# EAGLE design White (EAGLE 9.6.2)
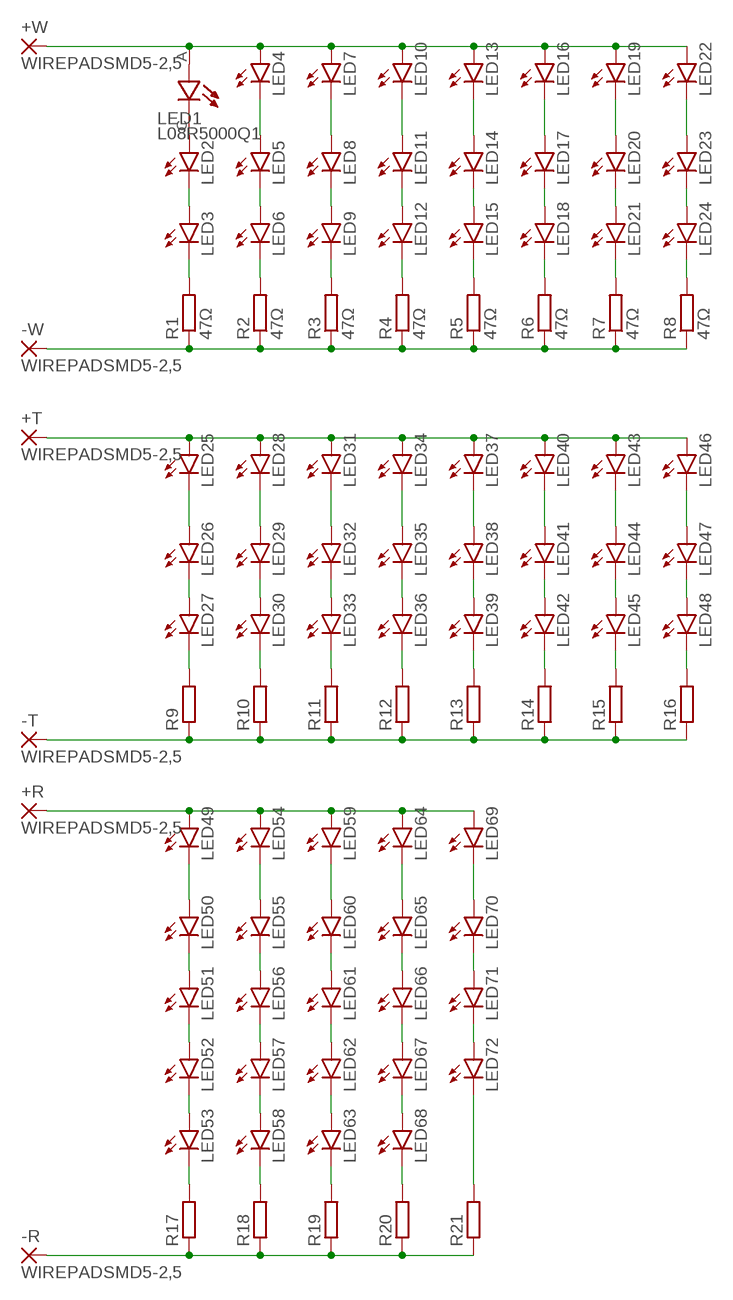
[diagram p0: schematic, sheet 1]

## Parts
+R  WIREPADSMD5-2,5  [5-2,5]
+T  WIREPADSMD5-2,5  [5-2,5]
+W  WIREPADSMD5-2,5  [5-2,5]
-R  WIREPADSMD5-2,5  [5-2,5]
-T  WIREPADSMD5-2,5  [5-2,5]
-W  WIREPADSMD5-2,5  [5-2,5]
LED1  L08R5000Q1  [LEDRD254W57D500H1070]
LED2  LED5MM  [LED5MM]
LED3  LED5MM  [LED5MM]
LED4  LED5MM  [LED5MM]
LED5  LED5MM  [LED5MM]
LED6  LED5MM  [LED5MM]
LED7  LED5MM  [LED5MM]
LED8  LED5MM  [LED5MM]
LED9  LED5MM  [LED5MM]
LED10  LED5MM  [LED5MM]
LED11  LED5MM  [LED5MM]
LED12  LED5MM  [LED5MM]
LED13  LED5MM  [LED5MM]
LED14  LED5MM  [LED5MM]
LED15  LED5MM  [LED5MM]
LED16  LED5MM  [LED5MM]
LED17  LED5MM  [LED5MM]
LED18  LED5MM  [LED5MM]
LED19  LED5MM  [LED5MM]
LED20  LED5MM  [LED5MM]
LED21  LED5MM  [LED5MM]
LED22  LED5MM  [LED5MM]
LED23  LED5MM  [LED5MM]
LED24  LED5MM  [LED5MM]
LED25  LED5MM  [LED5MM]
LED26  LED5MM  [LED5MM]
LED27  LED5MM  [LED5MM]
LED28  LED5MM  [LED5MM]
LED29  LED5MM  [LED5MM]
LED30  LED5MM  [LED5MM]
LED31  LED5MM  [LED5MM]
LED32  LED5MM  [LED5MM]
LED33  LED5MM  [LED5MM]
LED34  LED5MM  [LED5MM]
LED35  LED5MM  [LED5MM]
LED36  LED5MM  [LED5MM]
LED37  LED5MM  [LED5MM]
LED38  LED5MM  [LED5MM]
LED39  LED5MM  [LED5MM]
LED40  LED5MM  [LED5MM]
LED41  LED5MM  [LED5MM]
LED42  LED5MM  [LED5MM]
LED43  LED5MM  [LED5MM]
LED44  LED5MM  [LED5MM]
LED45  LED5MM  [LED5MM]
LED46  LED5MM  [LED5MM]
LED47  LED5MM  [LED5MM]
LED48  LED5MM  [LED5MM]
LED49  LED5MM  [LED5MM]
LED50  LED5MM  [LED5MM]
LED51  LED5MM  [LED5MM]
LED52  LED5MM  [LED5MM]
LED53  LED5MM  [LED5MM]
LED54  LED5MM  [LED5MM]
LED55  LED5MM  [LED5MM]
LED56  LED5MM  [LED5MM]
LED57  LED5MM  [LED5MM]
LED58  LED5MM  [LED5MM]
LED59  LED5MM  [LED5MM]
LED60  LED5MM  [LED5MM]
LED61  LED5MM  [LED5MM]
LED62  LED5MM  [LED5MM]
LED63  LED5MM  [LED5MM]
LED64  LED5MM  [LED5MM]
LED65  LED5MM  [LED5MM]
LED66  LED5MM  [LED5MM]
LED67  LED5MM  [LED5MM]
LED68  LED5MM  [LED5MM]
LED69  LED5MM  [LED5MM]
LED70  LED5MM  [LED5MM]
LED71  LED5MM  [LED5MM]
LED72  LED5MM  [LED5MM]
R1  47Ω  R-EU_0411/15  [0411/15]
R2  47Ω  R-EU_0411/15  [0411/15]
R3  47Ω  R-EU_0411/15  [0411/15]
R4  47Ω  R-EU_0411/15  [0411/15]
R5  47Ω  R-EU_0411/15  [0411/15]
R6  47Ω  R-EU_0411/15  [0411/15]
R7  47Ω  R-EU_0411/15  [0411/15]
R8  47Ω  R-EU_0411/15  [0411/15]
R9  R-EU_0207/12  [0207/12]
R10  R-EU_0207/12  [0207/12]
R11  R-EU_0207/12  [0207/12]
R12  R-EU_0207/12  [0207/12]
R13  R-EU_0207/12  [0207/12]
R14  R-EU_0207/12  [0207/12]
R15  R-EU_0207/12  [0207/12]
R16  R-EU_0207/12  [0207/12]
R17  R-EU_0207/12  [0207/12]
R18  R-EU_0207/12  [0207/12]
R19  R-EU_0207/12  [0207/12]
R20  R-EU_0207/12  [0207/12]
R21  R-EU_0207/12  [0207/12]

## Nets
N$1: LED1.C LED2.A
N$2: LED2.K(C) LED3.A
N$3: LED3.K(C) R1.2
N$4: +W.1(P) LED1.A LED4.A LED7.A LED10.A LED13.A LED16.A LED19.A LED22.A
N$5: LED25.K(C) LED26.A
N$6: LED4.K(C) LED5.A
N$7: LED5.K(C) LED6.A
N$8: LED6.K(C) R2.2
N$9: LED7.K(C) LED8.A
N$10: LED8.K(C) LED9.A
N$11: LED9.K(C) R3.2
N$12: LED10.K(C) LED11.A
N$13: LED11.K(C) LED12.A
N$14: LED12.K(C) R4.2
N$15: LED22.K(C) LED23.A
N$16: LED13.K(C) LED14.A
N$17: LED14.K(C) LED15.A
N$18: LED15.K(C) R5.2
N$19: LED16.K(C) LED17.A
N$20: LED17.K(C) LED18.A
N$21: LED18.K(C) R6.2
N$22: LED19.K(C) LED20.A
N$23: LED20.K(C) LED21.A
N$24: LED21.K(C) R7.2
N$25: LED23.K(C) LED24.A
N$26: LED24.K(C) R8.2
N$27: LED26.K(C) LED27.A
N$28: LED27.K(C) R9.2
N$29: +T.1(P) LED25.A LED28.A LED31.A LED34.A LED37.A LED40.A LED43.A LED46.A
N$30: LED28.K(C) LED29.A
N$31: LED29.K(C) LED30.A
N$32: LED30.K(C) R10.2
N$33: LED31.K(C) LED32.A
N$34: LED32.K(C) LED33.A
N$35: -W.1(P) R1.1 R2.1 R3.1 R4.1 R5.1 R6.1 R7.1 R8.1
N$36: LED33.K(C) R11.2
N$37: LED34.K(C) LED35.A
N$38: LED35.K(C) LED36.A
N$39: LED36.K(C) R12.2
N$40: LED37.K(C) LED38.A
N$41: LED38.K(C) LED39.A
N$42: LED39.K(C) R13.2
N$43: LED40.K(C) LED41.A
N$44: LED41.K(C) LED42.A
N$45: LED42.K(C) R14.2
N$46: LED43.K(C) LED44.A
N$47: LED44.K(C) LED45.A
N$48: LED45.K(C) R15.2
N$49: -T.1(P) R9.1 R10.1 R11.1 R12.1 R13.1 R14.1 R15.1 R16.1
N$50: LED46.K(C) LED47.A
N$51: LED47.K(C) LED48.A
N$52: LED48.K(C) R16.2
N$53: LED49.K(C) LED50.A
N$54: LED50.K(C) LED51.A
N$55: LED51.K(C) LED52.A
N$56: +R.1(P) LED49.A LED54.A LED59.A LED64.A LED69.A
N$57: -R.1(P) R17.1 R18.1 R19.1 R20.1 R21.1
N$58: LED52.K(C) LED53.A
N$59: LED53.K(C) R17.2
N$60: LED54.K(C) LED55.A
N$61: LED55.K(C) LED56.A
N$62: LED56.K(C) LED57.A
N$65: LED57.K(C) LED58.A
N$66: LED58.K(C) R18.2
N$67: LED59.K(C) LED60.A
N$68: LED60.K(C) LED61.A
N$69: LED61.K(C) LED62.A
N$72: LED62.K(C) LED63.A
N$73: LED63.K(C) R19.2
N$74: LED64.K(C) LED65.A
N$75: LED65.K(C) LED66.A
N$76: LED66.K(C) LED67.A
N$79: LED67.K(C) LED68.A
N$80: LED68.K(C) R20.2
N$81: LED69.K(C) LED70.A
N$82: LED70.K(C) LED71.A
N$83: LED71.K(C) LED72.A
N$87: LED72.K(C) R21.2

## Library data of the parts
+R +T +W -R -T -W = wirepad:WIREPAD: Wire PAD connect wire on PCB
LED1 = L08R5000Q1:L08R5000Q1: LED, Orange, Through Hole, T-1 3/4 (5mm), 30 mA, 2.1 V, 635 nm Check availability <https://pricing.snapeda.com/parts/L08R5000Q1/LED%20Technology/view-part?ref=eda>; AVAILABILITY: Not in stock; CHECK_PRICES: https://www.snapeda.com/parts/L08R5000Q1/LED+Technology/view-part/?ref=eda; DESCRIPTION: LED, 5MM, ORANGE; LED / Lamp Size: 5mm / T-1 3/4; LED Colour: Orange; Typ Luminous Intensity: 4.3mcd; Viewing Angle: ...; MF: LED Technology; MP: L08R5000Q1; PACKAGE: None; PRICE: None; SNAPEDA_LINK: https://www.snapeda.com/parts/L08R5000Q1/LED+Technology/view-part/?ref=snap
LED2-LED72 = led:LED: LED OSRAM: - CHIPLED LG R971, LG N971, LY N971, LG Q971, LY Q971, LO R971, LY R971 LH N974, LH R974 LS Q976, LO Q976, LY Q976 LO Q996 - Hyper CHIPLED LW Q18S LB Q993, LB Q99A, LB R99A - SideLED LS A670, LO A670, LY A670, LG A670, LP A670 LB A673, LV A673, LT A673, LW A673 LH A674 LY A675 LS A676, LA A676, LO A676, LY A676, LW A676 LS A679, LY A679, LG A679 - Hyper Micro SIDELED® LS Y876, LA Y876, LO Y876, LY Y876 LT Y87S - SmartLED LW L88C, LW L88S LB L89C, LB L89S, LG L890 LS L89K, LO L89K, LY L89K LS L896, LA L896, LO L896, LY L896 - TOPLED LS T670, LO T670, LY T670, LG T670, LP T670 LSG T670, LSP T670, LSY T670, LOP T670, LYG T670 LG T671, LOG T671, LSG T671 LB T673, LV T673, LT T673, LW T673 LH T674 LS T676, LA T676, LO T676, LY T676, LB T676, LH T676, LSB T676, LW T676 LB T67C, LV T67C, LT T67C, LS T67K, LO T67K, LY T67K, LW E67C LS E67B, LA E67B, LO E67B, LY E67B, LB E67C, LV E67C, LT E67C LW T67C LS T679, LY T679, LG T679 LS T770, LO T770, LY T770, LG T770, LP T770 LB T773, LV T773, LT T773, LW T773 LH T774 LS E675, LA E675, LY E675, LS T675 LS T776, LA T776, LO T776, LY T776, LB T776 LHGB T686 LT T68C, LB T68C - Hyper Mini TOPLED® LB M676 - Mini TOPLED Santana® LG M470 LS M47K, LO M47K, LY M47K Source: http://www.osram.convergy.de LUXEON: - LUMILED® LXK2-PW12-R00, LXK2-PW12-S00, LXK2-PW14-U00, LXK2-PW14-V00 LXK2-PM12-R00, LXK2-PM12-S00, LXK2-PM14-U00 LXK2-PE12-Q00, LXK2-PE12-R00, LXK2-PE12-S00, LXK2-PE14-T00, LXK2-PE14-U00 LXK2-PB12-K00, LXK2-PB12-L00, LXK2-PB12-M00, LXK2-PB14-N00, LXK2-PB14-P00, LXK2-PB14-Q00 LXK2-PR12-L00, LXK2-PR12-M00, LXK2-PR14-Q00, LXK2-PR14-R00 LXK2-PD12-Q00, LXK2-PD12-R00, LXK2-PD12-S00 LXK2-PH12-R00, LXK2-PH12-S00 LXK2-PL12-P00, LXK2-PL12-Q00, LXK2-PL12-R00 Source: www.luxeon.com KINGBRIGHT: KA-3528ASYC Source: www.kingbright.com
R1-R21 = rcl:R-EU_: RESISTOR, European symbol; SPICEPREFIX: R

## Board
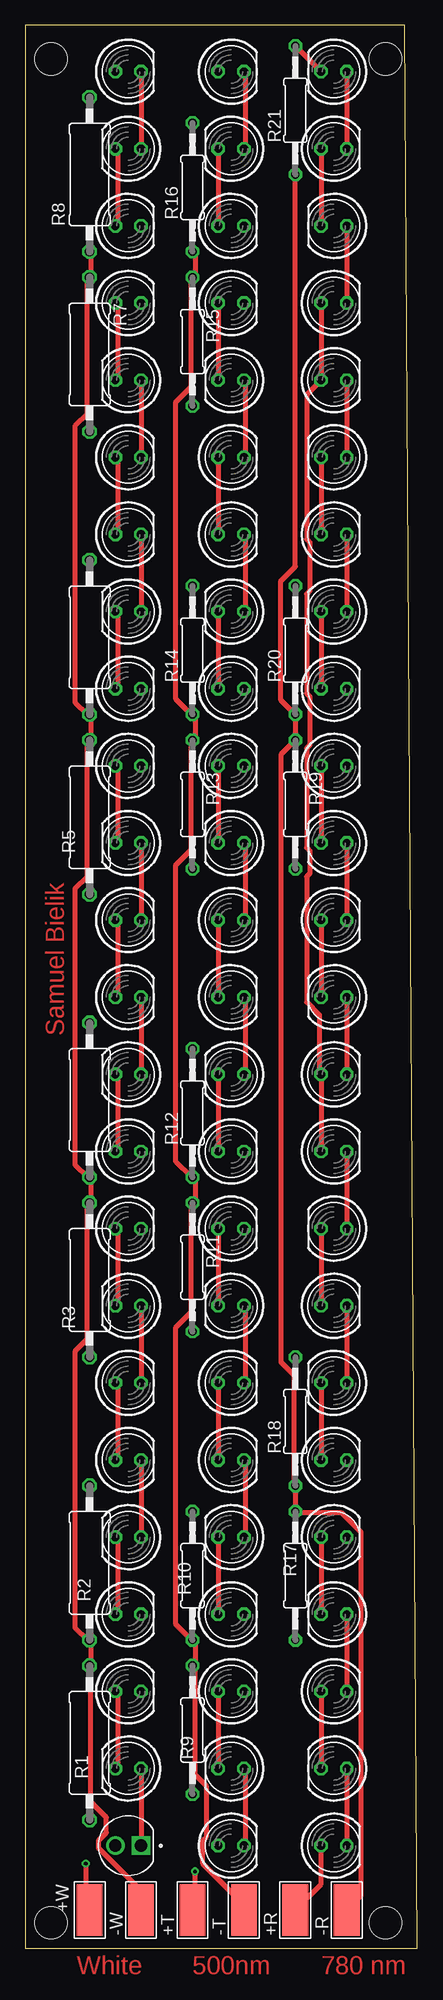
[diagram p1: board, top side]
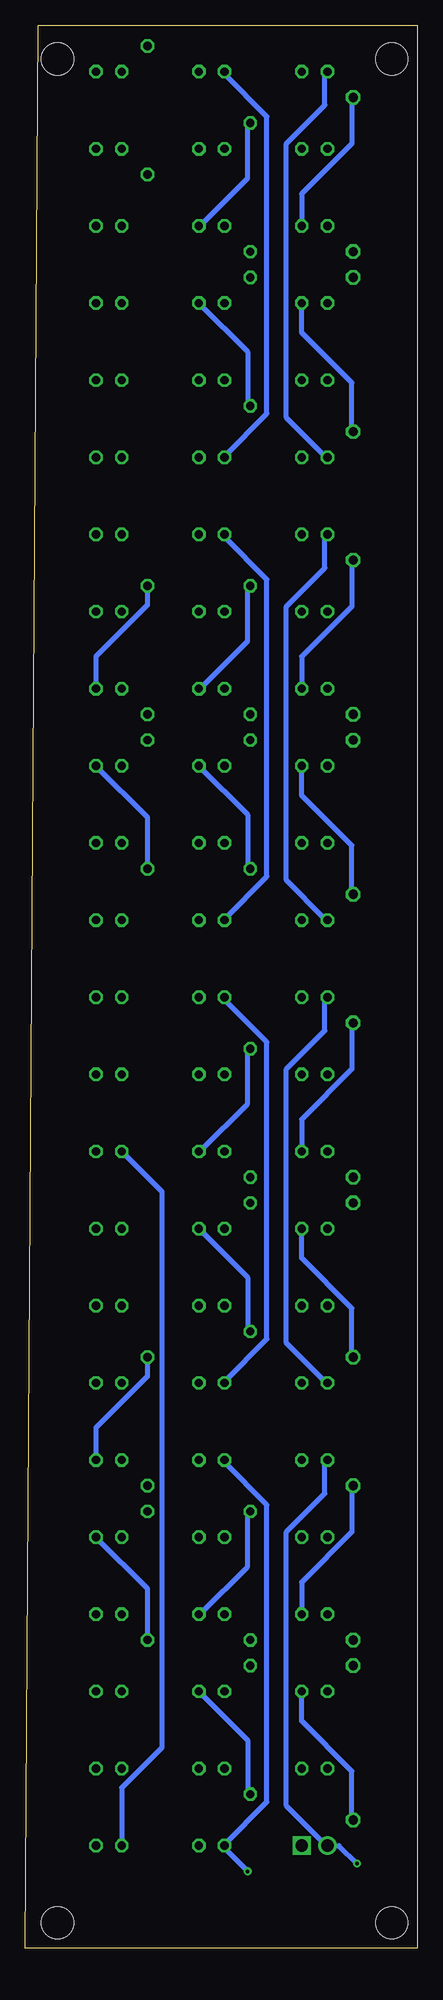
[diagram p2: board, bottom side, seen from below]

Size 38.73 x 190 mm. Coordinates in mm from the lower left corner, seen from the top.
Outline: 0,0 38.73,0 37.46,190 0,190 0,0
Copper layers (1*16): Top 0.25mm / dielectric 1.5mm / Bottom 0.25mm
Design rules "default *": minimum track width 20mil, minimum drill 0.35mm, track to track 10mil, track to pad 15mil, pad to pad 10mil, via to via 10mil, smd to smd 10mil, copper to edge 10mil, drill to drill 6mil, minimum pad ring 10mil, minimum via ring 8mil, stop-mask expansion 4mil, vias tented up to drill 0mil, thermal gap 10mil
Holes 3.2 mm at 2.54,186.69 35.56,186.69 35.56,2.54 2.54,2.54

### Footprints (pad centres in the part's own frame; a part is rotated, then mirrored left to right if it is on the bottom)
5-2,5 = smd 2.54 x 5.08: 1 0,0
LEDRD254W57D500H1070 = drill 1.21: A 1.27,0 | drill 1.21 square: C -1.27,0
LED5MM = drill 0.813 octagon: A -1.27,0; K 1.27,0
0411/15 = drill 0.914 octagon: 1 -7.62,0; 2 7.62,0
0207/12 = drill 0.813 octagon: 1 -6.35,0; 2 6.35,0

### Placement (x,y rotation side)
+R  26.67,3.81 0 top
+T  16.51,3.81 0 top
+W  6.35,3.81 0 top
-R  31.75,3.81 0 top
-T  21.59,3.81 0 top
-W  11.43,3.81 0 top
LED1  10.16,10.16 180 top
LED2  10.16,17.78 180 top
LED3  10.16,25.4 0 top
LED4  10.16,48.26 0 top
LED5  10.16,40.64 180 top
LED6  10.16,33.02 0 top
LED7  10.16,55.88 0 top
LED8  10.16,63.5 180 top
LED9  10.16,71.12 0 top
LED10  10.16,93.98 0 top
LED11  10.16,86.36 180 top
LED12  10.16,78.74 0 top
LED13  10.16,101.6 0 top
LED14  10.16,109.22 180 top
LED15  10.16,116.84 0 top
LED16  10.16,139.7 0 top
LED17  10.16,132.08 180 top
LED18  10.16,124.46 0 top
LED19  10.16,147.32 0 top
LED20  10.16,154.94 180 top
LED21  10.16,162.56 0 top
LED22  10.16,185.42 0 top
LED23  10.16,177.8 180 top
LED24  10.16,170.18 0 top
LED25  20.32,10.16 0 top
LED26  20.32,17.78 180 top
LED27  20.32,25.4 0 top
LED28  20.32,48.26 0 top
LED29  20.32,40.64 180 top
LED30  20.32,33.02 0 top
LED31  20.32,55.88 0 top
LED32  20.32,63.5 180 top
LED33  20.32,71.12 0 top
LED34  20.32,93.98 0 top
LED35  20.32,86.36 180 top
LED36  20.32,78.74 0 top
LED37  20.32,101.6 0 top
LED38  20.32,109.22 180 top
LED39  20.32,116.84 0 top
LED40  20.32,139.7 0 top
LED41  20.32,132.08 180 top
LED42  20.32,124.46 0 top
LED43  20.32,147.32 0 top
LED44  20.32,154.94 180 top
LED45  20.32,162.56 0 top
LED46  20.32,185.42 0 top
LED47  20.32,177.8 180 top
LED48  20.32,170.18 0 top
LED49  30.48,10.16 0 top
LED50  30.48,17.78 180 top
LED51  30.48,25.4 0 top
LED52  30.48,33.02 180 top
LED53  30.48,40.64 0 top
LED54  30.48,78.74 0 top
LED55  30.48,71.12 180 top
LED56  30.48,63.5 0 top
LED57  30.48,55.88 180 top
LED58  30.48,48.26 0 top
LED59  30.48,86.36 0 top
LED60  30.48,93.98 180 top
LED61  30.48,101.6 0 top
LED62  30.48,109.22 180 top
LED63  30.48,116.84 0 top
LED64  30.48,154.94 0 top
LED65  30.48,147.32 180 top
LED66  30.48,139.7 0 top
LED67  30.48,132.08 180 top
LED68  30.48,124.46 0 top
LED69  30.48,162.56 0 top
LED70  30.48,170.18 180 top
LED71  30.48,177.8 0 top
LED72  30.48,185.42 180 top
R1  6.35,20.32 270 top
R2  6.35,38.1 90 top
R3  6.35,66.04 270 top
R4  6.35,83.82 90 top
R5  6.35,111.76 270 top
R6  6.35,129.54 90 top
R7  6.35,157.48 270 top
R8  6.35,175.26 90 top
R9  16.51,21.59 270 top
R10  16.51,36.83 90 top
R11  16.51,67.31 270 top
R12  16.51,82.55 90 top
R13  16.51,113.03 270 top
R14  16.51,128.27 90 top
R15  16.51,158.75 270 top
R16  16.51,173.99 90 top
R17  26.67,36.83 270 top
R18  26.67,52.07 90 top
R19  26.67,113.03 270 top
R20  26.67,128.27 90 top
R21  26.67,181.61 90 top

### Tracks (layer width: path | path; a pad name or v marks a point on that pad's centre or on a via)
N$1
  Top 0.508: LED2.A LED1.C
N$2
  Top 0.508: LED2.K 9.14,17.91 9.14,25.15 LED3.A
N$3
  Bottom 0.508: LED3.K 11.43,22.48 6.48,17.53 6.48,12.95 R1.2
N$4  (via drill 0.35)
  Top 0.508: LED16.A 9.14,139.83 9.14,147.07 LED19.A | LED10.A 9.14,94.11 9.14,101.35 LED13.A | LED4.A 9.14,48.39 9.14,55.63 LED7.A | +W.1 5.97,4.19 v5.97,8.38
  Bottom 0.508: LED22.A 9.14,185.17 9.14,182.12 12.95,178.31 12.95,151.26 9.14,147.45 LED19.A | v5.97,8.38 7.75,10.16 LED1.A 9.14,10.29 12.95,14.1 12.95,41.15 9.14,44.96 9.14,48.01 LED4.A | LED10.A 9.14,93.73 9.14,90.68 12.95,86.87 12.95,59.82 9.14,56.01 LED7.A | LED16.A 9.14,139.45 9.14,136.4 12.95,132.59 12.95,105.54 9.14,101.73 LED13.A
N$5
  Top 0.508: LED25.K 21.72,10.29 21.72,17.53 LED26.A
N$6
  Top 0.508: LED4.K LED5.A
N$7
  Top 0.508: LED6.A 9.14,33.15 9.14,40.39 LED5.K
N$8
  Bottom 0.508: LED6.K 11.43,36.2 6.48,41.15 6.48,45.72 R2.2
N$9
  Top 0.508: LED8.A LED7.K
N$10
  Top 0.508: LED8.K 9.14,63.63 9.14,70.87 LED9.A
N$11
  Bottom 0.508: LED9.K 11.43,68.2 6.48,63.25 6.48,58.67 R3.2
N$12
  Top 0.508: LED10.K LED11.A
N$13
  Top 0.508: LED12.A 9.14,78.87 9.14,86.11 LED11.K
N$14
  Bottom 0.508: LED12.K 11.43,81.92 6.48,86.87 6.48,91.44 R4.2
N$15
  Top 0.508: LED22.K LED23.A
N$16
  Top 0.508: LED14.A LED13.K
N$17
  Top 0.508: LED14.K 9.14,109.35 9.14,116.59 LED15.A
N$18
  Bottom 0.508: LED15.K 11.43,113.92 6.48,108.97 6.48,104.39 R5.2
N$19
  Top 0.508: LED16.K LED17.A
N$20
  Top 0.508: LED18.A 9.14,124.59 9.14,131.83 LED17.K
N$21
  Bottom 0.508: LED18.K 11.43,127.64 6.48,132.59 6.48,137.16 R6.2
N$22
  Top 0.508: LED20.A LED19.K
N$23
  Top 0.508: LED20.K 9.14,155.07 9.14,162.31 LED21.A
N$24
  Bottom 0.508: LED21.K 11.43,159.64 6.48,154.69 6.48,150.11 R7.2
N$25
  Top 0.508: LED24.A 9.14,170.31 9.14,177.55 LED23.K
N$26
  Bottom 0.508: LED24.K 11.43,173.35 6.48,178.31 6.48,182.88 R8.2
N$27
  Top 0.508: LED27.A LED26.K
N$28
  Bottom 0.508: LED27.K 16.76,20.57 16.76,15.24 R9.2
N$29  (via drill 0.35)
  Top 0.508: LED43.A LED40.A | LED37.A LED34.A | LED31.A LED28.A | v16.76,7.62 16.76,3.81 +T.1
  Bottom 0.508: LED46.A 19.05,185.17 14.86,180.97 14.86,151.64 19.05,147.45 LED43.A | v16.76,7.62 19.05,9.91 LED25.A 19.05,10.29 14.86,14.48 14.86,43.81 19.05,48.01 LED28.A | LED34.A 19.05,93.73 14.86,89.53 14.86,60.2 19.05,56.01 LED31.A | LED40.A 19.05,139.45 14.86,135.25 14.86,105.92 19.05,101.73 LED37.A
N$30
  Top 0.508: LED29.A 21.72,40.77 21.72,48.01 LED28.K
N$31
  Top 0.508: LED29.K LED30.A
N$32
  Bottom 0.508: R10.2 16.76,43.05 16.76,37.72 21.34,33.15 LED30.K
N$33
  Top 0.508: LED31.K 21.72,56.01 21.72,63.25 LED32.A
N$34
  Top 0.508: LED33.A LED32.K
N$35
  Top 0.508: R8.1 6.48,167.64 6.48,165.35 R7.1 6.1,164.97 6.1,151.64 4.95,150.5 4.95,123.06 6.1,121.92 R6.1 6.48,121.92 6.48,119.63 R5.1 6.1,119.25 6.1,105.92 4.95,104.78 4.95,77.34 6.1,76.2 R4.1 6.48,76.2 6.48,73.91 R3.1 6.1,73.53 6.1,60.2 4.95,59.05 4.95,31.62 6.1,30.48 R2.1 6.48,30.48 6.48,28.19 R1.1 6.48,27.81 6.48,14.48 8,12.95 8,11.43 7.24,10.67 7.24,9.91 11.43,5.71 -W.1
N$36
  Bottom 0.508: LED33.K 16.76,66.29 16.76,60.96 R11.2
N$37
  Top 0.508: LED35.A 21.72,86.49 21.72,93.73 LED34.K
N$38
  Top 0.508: LED35.K LED36.A
N$39
  Bottom 0.508: R12.2 16.76,88.77 16.76,83.44 21.34,78.87 LED36.K
N$40
  Top 0.508: LED37.K 21.72,101.73 21.72,108.97 LED38.A
N$41
  Top 0.508: LED39.A LED38.K
N$42
  Bottom 0.508: LED39.K 16.76,112.01 16.76,106.68 R13.2
N$43
  Top 0.508: LED41.A 21.72,132.21 21.72,139.45 LED40.K
N$44
  Top 0.508: LED41.K LED42.A
N$45
  Bottom 0.508: R14.2 16.76,134.49 16.76,129.16 21.34,124.59 LED42.K
N$46
  Top 0.508: LED43.K 21.72,147.45 21.72,154.69 LED44.A
N$47
  Top 0.508: LED45.A LED44.K
N$48
  Bottom 0.508: LED45.K 16.76,157.73 16.76,152.4 R15.2
N$49
  Top 0.508: R16.1 16.76,167.64 16.76,165.35 R15.1 16.38,164.97 16.38,154.31 14.86,152.78 14.86,123.44 16.38,121.92 R14.1 16.76,121.92 16.76,119.63 R13.1 16.38,119.25 16.38,108.58 14.86,107.06 14.86,77.72 16.38,76.2 R12.1 16.76,76.2 16.76,73.91 R11.1 16.38,73.53 16.38,62.87 14.86,61.34 14.86,32 16.38,30.48 R10.1 16.76,30.48 16.76,28.19 R9.1 16.76,27.81 16.76,17.14 17.91,16 17.91,11.05 17.53,10.67 17.53,8.38 21.34,4.57 21.34,3.81 -T.1
N$50
  Top 0.508: LED47.A 21.72,177.93 21.72,185.17 LED46.K
N$51
  Top 0.508: LED47.K LED48.A
N$52
  Bottom 0.508: R16.2 16.76,180.21 16.76,174.88 21.34,170.31 LED48.K
N$53
  Top 0.508: LED50.A LED49.K
N$54
  Top 0.508: LED51.A LED50.K
N$55
  Top 0.508: LED52.A LED51.K
N$56
  Top 0.508: LED49.A 29.21,6.35 +R.1 | LED54.A LED59.A 29.05,86.52 29.05,92.23 27.78,93.5 27.78,105.89 28.1,106.2 28.1,108.43 27.78,108.74 27.78,118.59 28.1,118.9 28.1,123.67 27.78,123.98 27.78,133.83 28.1,134.14 28.1,138.91 27.78,139.22 27.78,153.51 LED64.A LED69.A
  Bottom 0.508: LED49.A 29.21,15.88 25.24,19.84 25.24,74.77 LED54.A
N$57
  Top 0.508: -R.1 33.18,5.24 33.18,41.12 31.27,43.02 26.83,43.02 R17.1 R18.1 26.51,45.88 26.51,56.67 25.24,57.94 25.24,117.95 R19.1 R20.1 25.24,123.35 25.24,135.1 26.67,136.53 R21.1
N$58
  Top 0.508: LED53.A LED52.K
N$59
  Bottom 0.508: R17.2 26.67,35.56 LED53.K
N$60
  Top 0.508: LED54.K LED55.A
N$61
  Top 0.508: LED55.K LED56.A
N$62
  Top 0.508: LED56.K LED57.A
N$65
  Top 0.508: LED57.K LED58.A
N$66
  Bottom 0.508: LED58.K 31.75,51.44 26.67,56.52 R18.2
N$67
  Top 0.508: LED60.A LED59.K
N$68
  Top 0.508: LED61.A LED60.K
N$69
  Top 0.508: LED62.A LED61.K
N$72
  Top 0.508: LED63.A LED62.K
N$73
  Bottom 0.508: R19.2 26.67,111.76 LED63.K
N$74
  Top 0.508: LED64.K LED65.A
N$75
  Top 0.508: LED65.K LED66.A
N$76
  Top 0.508: LED66.K LED67.A
N$79
  Top 0.508: LED67.K LED68.A
N$80
  Bottom 0.508: LED68.K 31.75,127.64 26.67,132.72 R20.2
N$81
  Top 0.508: LED70.A LED69.K
N$82
  Top 0.508: LED71.A LED70.K
N$83
  Top 0.508: LED72.A LED71.K
N$87
  Top 0.508: R21.2 LED72.K

### Text on the board
Top: Samuel Bielik | White | 500nm | 780 nm